# EAGLE design 5_TTY (EAGLE 7.6.0)
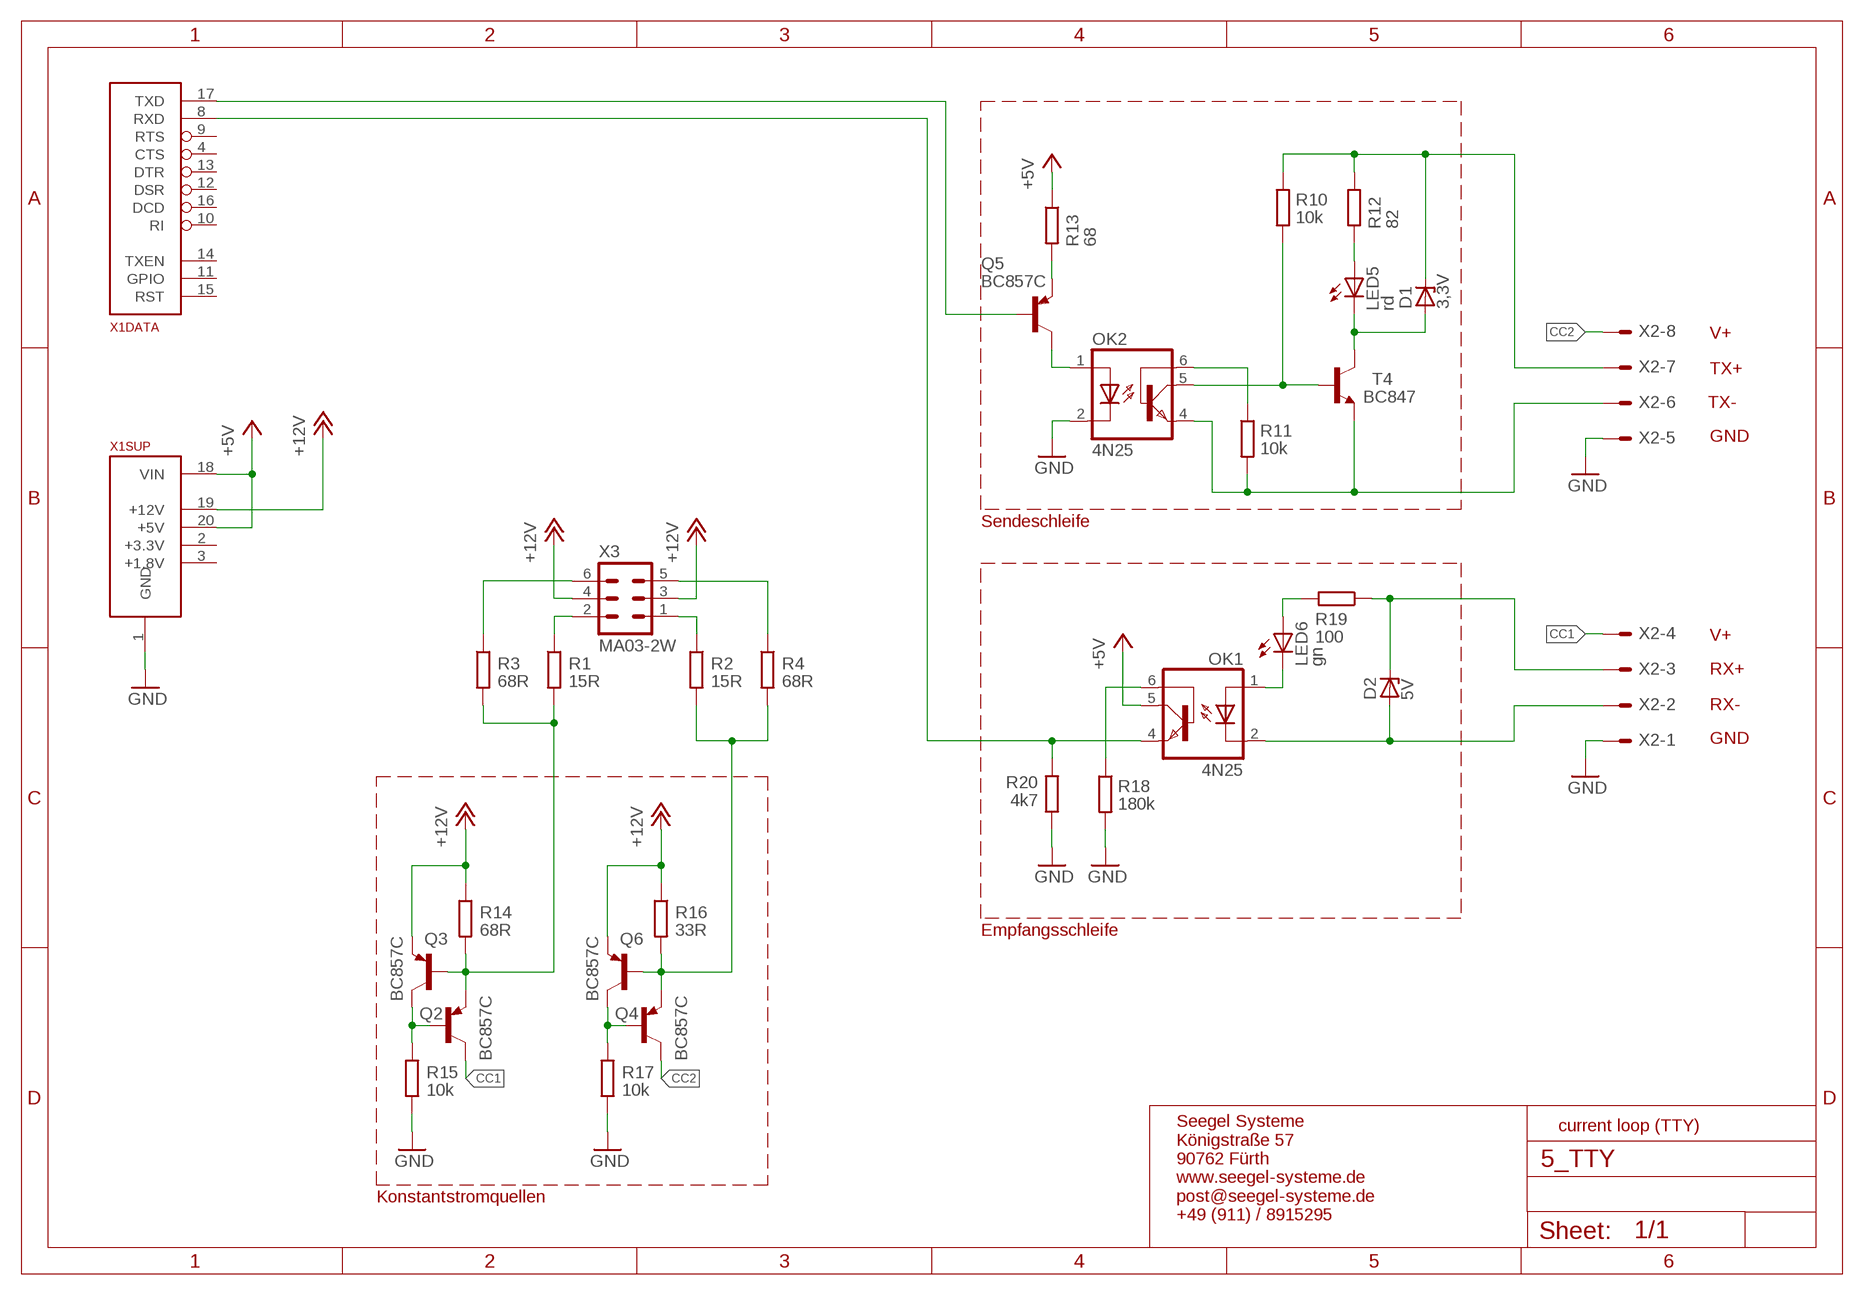
[diagram p0: schematic, sheet 1]

## Parts
D1  3,3V  ZENER-DIODESOT23  [SOT23]
D2  5V  ZENER-DIODESOT23  [SOT23]
LED5  rd  LEDCHIPLED_0603  [CHIPLED_0603]
LED6  gn  LEDCHIPLED_0603  [CHIPLED_0603]
OK1  4N25  4N35  [DIL06]
OK2  4N25  4N35  [DIL06]
Q2  BC857C  BC857CSMD  [SOT23-BEC]
Q3  BC857C  BC857CSMD  [SOT23-BEC]
Q4  BC857C  BC857CSMD  [SOT23-BEC]
Q5  BC857C  BC857CSMD  [SOT23-BEC]
Q6  BC857C  BC857CSMD  [SOT23-BEC]
R1  15R  R-EU_R0805  [R0805]
R2  15R  R-EU_R0805  [R0805]
R3  68R  R-EU_R0805  [R0805]
R4  68R  R-EU_R0805  [R0805]
R10  10k  R-EU_R0805  [R0805]
R11  10k  R-EU_R0805  [R0805]
R12  82  R-EU_R0805  [R0805]
R13  68  R-EU_R0805  [R0805]
R14  68R  R-EU_R0805  [R0805]
R15  10k  R-EU_R0805  [R0805]
R16  33R  R-EU_R0805  [R0805]
R17  10k  R-EU_R0805  [R0805]
R18  180k  R-EU_R0805  [R0805]
R19  100  R-EU_R0805  [R0805]
R20  4k7  R-EU_R0805  [R0805]
T4  BC847  [SOT23]
X1  ALLSERIALSLAVE  [DAUGHTER-THT]
X2  AKL18X-08W  [AKL182-08]
X3  MA03-2W  [MA03-2W]

## Nets
+5V: OK1.5(COL) R13.1 X1.18(SUP:VIN) X1.20(SUP:+5V)
+12V: Q3.E Q6.E R14.1 R16.1 X1.19(SUP:+12V) X3.3 X3.4
CC1: Q2.C X2.P$4
CC2: Q4.C X2.P$8
GND: OK2.2(C) R15.1 R17.1 R18.2 R20.1 X1.1(SUP:GND) X2.P$1 X2.P$5
N$1: OK1.6(BAS) R18.1
N$2: R1.1 X3.2
N$3: R2.1 X3.1
N$4: OK2.4(EMI) R11.2 T4.2(E) X2.P$6
N$5: R3.1 X3.6
N$6: R4.1 X3.5
N$7: D2.3(C) R19.1 X2.P$3
N$8: D2.1(A) OK1.2(C) X2.P$2
N$45: Q4.B Q6.C R17.2
N$46: OK1.4(EMI) R20.2 X1.8(DATA:RXD)
N$49: Q4.E Q6.B R2.2 R4.2 R16.2
N$54: OK2.6(BAS) R11.1
N$55: OK2.5(COL) R10.2 T4.1(B)
N$56: D1.1(A) LED5.C T4.3(C)
N$57: Q2.B Q3.C R15.2
N$58: LED5.A R12.2
N$59: Q2.E Q3.B R1.2 R3.2 R14.2
N$60: OK2.1(A) Q5.C
N$61: Q5.E R13.2
N$63: LED6.C OK1.1(A)
N$64: LED6.A R19.2
N$91: Q5.B X1.17(DATA:TXD)
TXP: D1.3(C) R10.1 R12.1 X2.P$7
Unconnected: X1.2(SUP:+3.3V) X1.3(SUP:+1.8V) X1.4(DATA:CTS) X1.5(USB:D-) X1.6(USB:D+) X1.7(USB:VUSB) X1.9(DATA:RTS) X1.10(DATA:RI) X1.11(DATA:GPIO) X1.12(DATA:DSR) X1.13(DATA:DTR) X1.14(DATA:TXEN) X1.15(DATA:RST) X1.16(DATA:DCD)

## Notes on the sheet
- V+
- TX+
- TX-
- GND
- Sendeschleife
- V+
- RX+
- RX-
- GND
- Empfangsschleife
- current loop (TTY)
- Konstantstromquellen
- Seegel Systeme
  Königstraße 57
  90762 Fürth
  www.seegel-systeme.de
  post@seegel-systeme.de
  +49 (911) / 8915295

## Library data of the parts
D1 D2 = diode:ZENER-DIODE: Z-Diode
LED5 LED6 = led:LED: LED OSRAM: - CHIPLED LG R971, LG N971, LY N971, LG Q971, LY Q971, LO R971, LY R971 LH N974, LH R974 LS Q976, LO Q976, LY Q976 LO Q996 - Hyper CHIPLED LW Q18S LB Q993, LB Q99A, LB R99A - SideLED LS A670, LO A670, LY A670, LG A670, LP A670 LB A673, LV A673, LT A673, LW A673 LH A674 LY A675 LS A676, LA A676, LO A676, LY A676, LW A676 LS A679, LY A679, LG A679 - Hyper Micro SIDELED® LS Y876, LA Y876, LO Y876, LY Y876 LT Y87S - SmartLED LW L88C, LW L88S LB L89C, LB L89S, LG L890 LS L89K, LO L89K, LY L89K LS L896, LA L896, LO L896, LY L896 - TOPLED LS T670, LO T670, LY T670, LG T670, LP T670 LSG T670, LSP T670, LSY T670, LOP T670, LYG T670 LG T671, LOG T671, LSG T671 LB T673, LV T673, LT T673, LW T673 LH T674 LS T676, LA T676, LO T676, LY T676, LB T676, LH T676, LSB T676, LW T676 LB T67C, LV T67C, LT T67C, LS T67K, LO T67K, LY T67K, LW E67C LS E67B, LA E67B, LO E67B, LY E67B, LB E67C, LV E67C, LT E67C LW T67C LS T679, LY T679, LG T679 LS T770, LO T770, LY T770, LG T770, LP T770 LB T773, LV T773, LT T773, LW T773 LH T774 LS E675, LA E675, LY E675, LS T675 LS T776, LA T776, LO T776, LY T776, LB T776 LHGB T686 LT T68C, LB T68C - Hyper Mini TOPLED® LB M676 - Mini TOPLED Santana® LG M470 LS M47K, LO M47K, LY M47K Source: http://www.osram.convergy.de LUXEON: - LUMILED® LXK2-PW12-R00, LXK2-PW12-S00, LXK2-PW14-U00, LXK2-PW14-V00 LXK2-PM12-R00, LXK2-PM12-S00, LXK2-PM14-U00 LXK2-PE12-Q00, LXK2-PE12-R00, LXK2-PE12-S00, LXK2-PE14-T00, LXK2-PE14-U00 LXK2-PB12-K00, LXK2-PB12-L00, LXK2-PB12-M00, LXK2-PB14-N00, LXK2-PB14-P00, LXK2-PB14-Q00 LXK2-PR12-L00, LXK2-PR12-M00, LXK2-PR14-Q00, LXK2-PR14-R00 LXK2-PD12-Q00, LXK2-PD12-R00, LXK2-PD12-S00 LXK2-PH12-R00, LXK2-PH12-S00 LXK2-PL12-P00, LXK2-PL12-Q00, LXK2-PL12-R00 Source: www.luxeon.com KINGBRIGHT: KA-3528ASYC Source: www.kingbright.com
OK1 OK2 = optocoupler:4N35: MOTOROLA OPTO COUPLER; FARNELL: 1612454; MF: FAIRCHILD SEMICONDUCTOR; MPN: 4N35; OC_FARNELL: 1328375; OC_NEWARK: 72K9946
Q2-Q6 = transistor-pnp:BC857*: PNP Transistror; FARNELL: 8734771
R1-R4 R14 R16 = resistor:R-EU_: RESISTOR, European symbol; FARNELL: 2498090
R10 R11 R18 = resistor:R-EU_: RESISTOR, European symbol; FARNELL: 2498051
R12 R13 R19 = resistor:R-EU_: RESISTOR, European symbol; FARNELL: 2498057
R15 R17 = resistor:R-EU_: RESISTOR, European symbol; FARNELL: 2502672
R20 = resistor:R-EU_: RESISTOR, European symbol; FARNELL: 2498050
T4 = transistor:BC847: NPN TRANSISTOR; FARNELL: 1081230
X1 = AllSerialv2:ALLSERIALSLAVE
X2 = con-riacon_akl:AKL18X-08: Riacon AKL18X Steckverbinder 8-Pol Grid = 3,5mm
X3 = con-lstb:MA03-2W

## Board
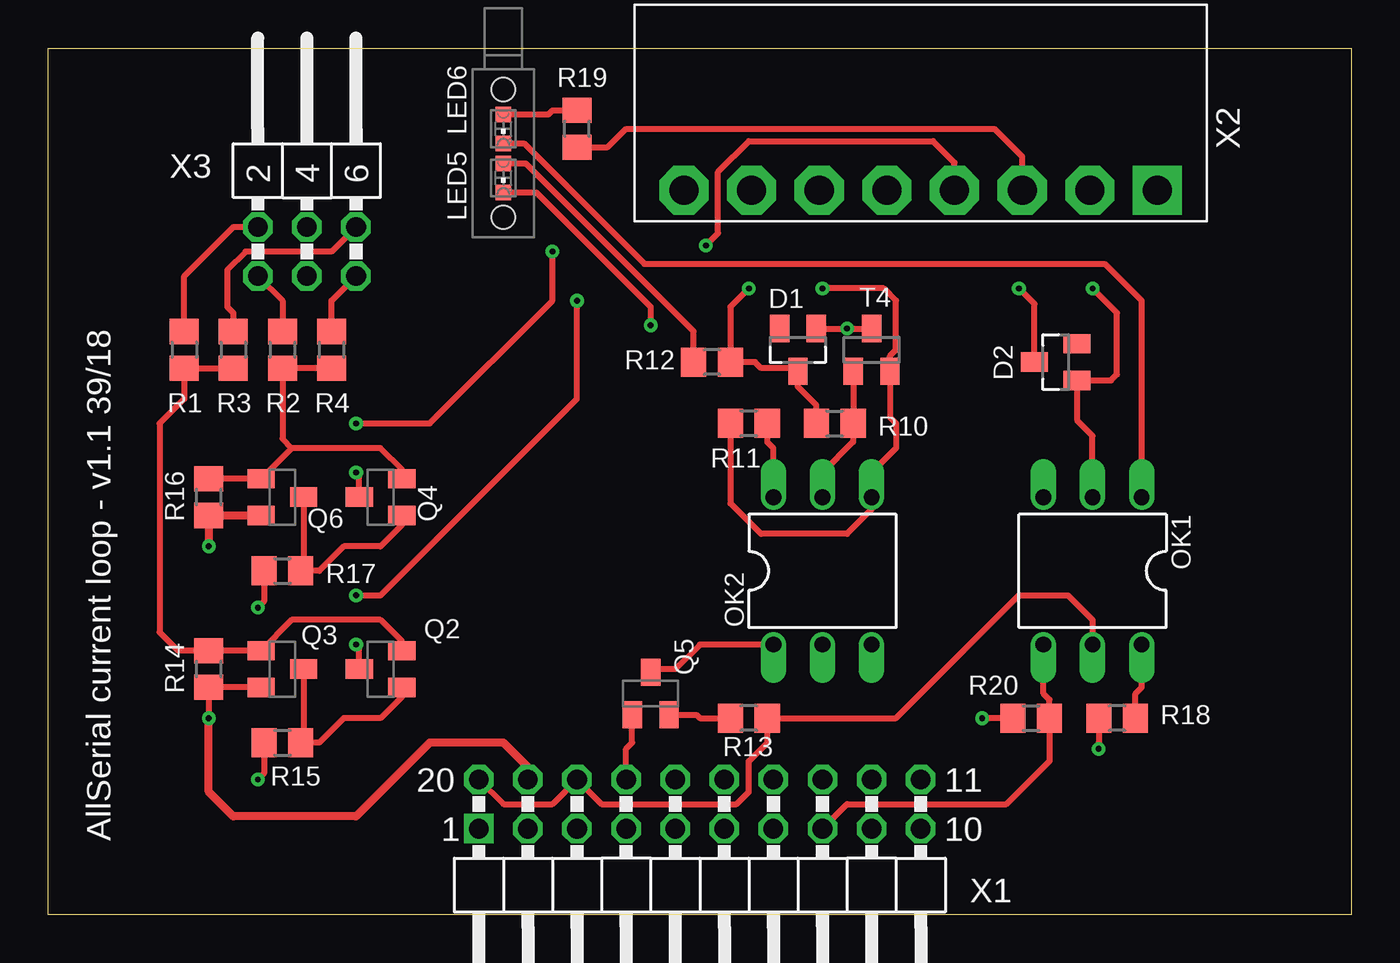
[diagram p1: board, top side]
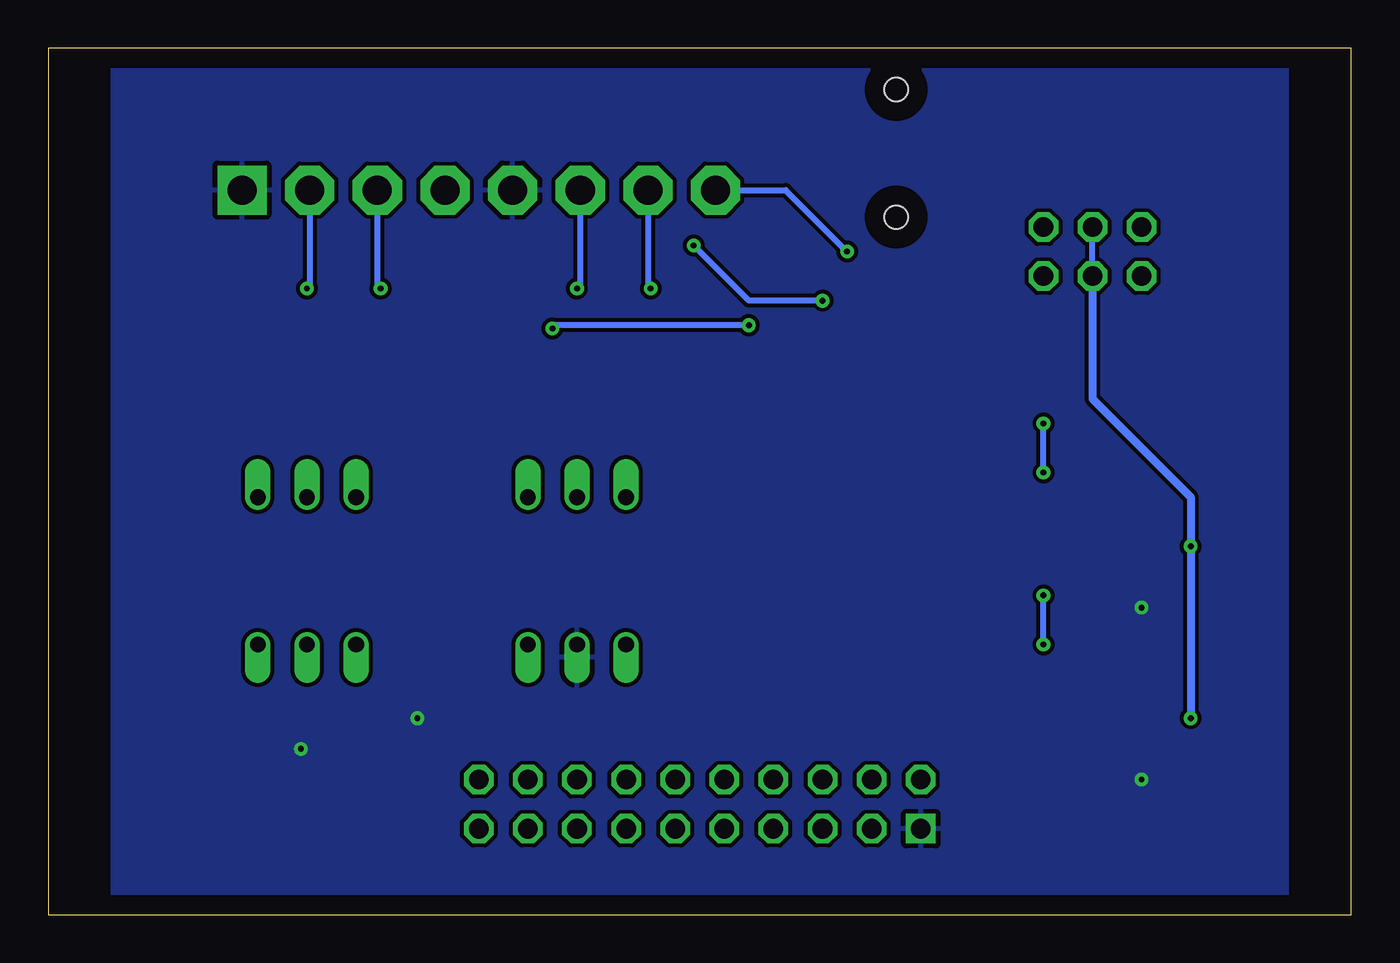
[diagram p2: board, bottom side, seen from below]

Size 67.4 x 44.8 mm. Coordinates in mm from the lower left corner, seen from the top.
Copper layers (1*16): Top 0.035mm / dielectric 1.5mm / Bottom 0.035mm
Design rules "default *": minimum track width 10mil, minimum drill 0.3mm, track to track 8mil, track to pad 8mil, pad to pad 8mil, via to via 8mil, smd to smd 8mil, copper to edge 40mil, drill to drill 8mil, minimum pad ring 10mil, minimum via ring 8mil, stop-mask expansion 4mil, vias tented up to drill 0.3mm, thermal gap 10mil

### Footprints (pad centres in the part's own frame; a part is rotated, then mirrored left to right if it is on the bottom)
SOT23 = smd 1 x 1.4: 1 -0.95,-1.1; 2 0.95,-1.1; 3 0,1.1
CHIPLED_0603 = smd 0.8 x 0.8: A 0,-0.75; C 0,0.75
DIL06 = drill 0.813 offset: 1 -2.54,-3.81; 2 0,-3.81; 3 2.54,-3.81; 4 2.54,3.81; 5 0,3.81; 6 -2.54,3.81
SOT23-BEC = smd 1 x 1.4: B -0.95,-1.1; C 0,1.1; E 0.95,-1.1
R0805 = smd 1.3 x 1.5: 1 -0.95,0; 2 0.95,0
1296.2012 = hole 1.2: 0,3.3; 0,-3.3
DAUGHTER-THT = drill 1.016 square: 1 -11.43,4.445 | drill 1.016 octagon: 2 -8.89,4.445; 3 -6.35,4.445; 4 -3.81,4.445; 5 -1.27,4.445; 6 1.27,4.445; 7 3.81,4.445; 8 6.35,4.445; 9 8.89,4.445; 10 11.43,4.445; 11 11.43,6.985; 12 8.89,6.985; 13 6.35,6.985; 14 3.81,6.985; 15 1.27,6.985; 16 -1.27,6.985; 17 -3.81,6.985; 18 -6.35,6.985; 19 -8.89,6.985; 20 -11.43,6.985
AKL182-08 = drill 1.5 pad 2.54 square: P$1 -12.25,0 | drill 1.5 pad 2.54 octagon: P$2 -8.75,0; P$3 -5.25,0; P$4 -1.75,0; P$5 1.75,0; P$6 5.25,0; P$7 8.75,0; P$8 12.25,0
MA03-2W = drill 1.016 octagon: 1 -2.54,-1.27; 2 -2.54,1.27; 3 0,-1.27; 4 0,1.27; 5 2.54,-1.27; 6 2.54,1.27

### Placement (x,y rotation side)
D1  38.78,29.21 180 top
D2  52.12,28.57 90 top
LED5  23.54,38.1 180 top
LED6  23.54,40.64 180 top
OK1  54.02,17.78 180 top
OK2  40.05,17.78 0 top
Q2  17.19,12.7 90 top
Q3  12.11,12.7 270 top
Q4  17.19,21.59 90 top
Q5  31.16,11.43 0 top
Q6  12.11,21.59 270 top
R1  7.03,29.21 270 top
R2  12.11,29.21 270 top
R3  9.57,29.21 270 top
R4  14.65,29.21 270 top
R10  40.69,25.4 0 top
R11  36.24,25.4 180 top
R12  34.34,28.57 180 top
R13  36.24,10.16 180 top
R14  8.3,12.7 90 top
R15  12.11,8.89 0 top
R16  8.3,21.59 90 top
R17  12.11,17.78 0 top
R18  55.29,10.16 180 top
R19  27.35,40.64 90 top
R20  50.85,10.16 0 top
T4  42.59,29.21 0 top
U$7  [1296.2012]  23.54,39.37 0 top
X1  33.7,0 0 top
X2  45.13,37.47 180 top
X3  13.38,34.29 0 top

### Tracks (layer width: path | path; a pad name or v marks a point on that pad's centre or on a via)
+5V
  Top 0.305: X1.20 23.54,5.71 26.08,5.71 X1.18 28.62,5.71 35.61,5.71 36.24,6.35 36.24,7.94 37.19,8.89 R13.1 43.86,10.16 50.21,16.51 52.75,16.51 54.02,15.24 OK1.5
+12V  (via drill 0.3)
  Top 0.305: Q3.E R14.1 v8.3,10.16
  Top 0.406: Q6.E R16.1 v8.3,19.05 | X1.19 24.81,7.62 23.54,8.89 19.73,8.89 15.92,5.08 9.57,5.08 8.3,6.35 v8.3,10.16
  Bottom 0.305: X3.3 X3.4
  Bottom 0.406: v8.3,10.16 v8.3,19.05 8.3,21.59 13.38,26.67 X3.3
CC1  (via drill 0.3)
  Top 0.305: Q2.C 16.09,13.8 v15.92,13.97 | v15.92,16.51 17.19,16.51 27.35,26.67 v27.35,31.75 | v34.02,34.61 34.65,35.24 34.65,38.42 36.24,40.01 45.77,40.01 46.88,38.89 X2.P$4
  Bottom 0.305: v15.92,13.97 v15.92,16.51 | v27.35,31.75 31.16,31.75 v34.02,34.61
CC2  (via drill 0.3)
  Top 0.305: Q4.C 16.09,22.69 v15.92,22.86 | v15.92,25.4 19.73,25.4 26.08,31.75 v26.08,34.29
  Bottom 0.305: X2.P$8 29.26,37.47 v26.08,34.29 | v15.92,22.86 v15.92,25.4
GND  (via drill 0.3)
  Top 0.305: R15.1 11.16,7.3 v10.84,6.99 | R17.1 11.16,16.2 v10.84,15.88 | R20.1 v48.31,10.16 | R18.2 54.34,8.89 v54.34,8.57
  pour Bottom: -0.59,0 67.99,0 67.99,45.72 -0.59,45.72
N$1
  Top 0.305: R18.1 56.24,11.43 56.56,11.75 OK1.6
N$2
  Top 0.305: X3.2 9.57,35.56 7.03,33.02 R1.1
N$3
  Top 0.305: X3.1 12.11,31.75 R2.1
N$4  (via drill 0.3)
  Top 0.305: R11.2 35.29,21.27 36.88,19.68 41.32,19.68 42.59,20.95 OK2.4 42.59,22.86 43.86,24.13 43.86,25.4 43.54,25.72 T4.2 | 43.71,27.94 T4.2 | T4.2 43.54,28.89 43.86,29.21 43.86,31.75 43.23,32.38 v40.05,32.38
  Bottom 0.305: X2.P$6 39.88,32.55 v40.05,32.38
N$5
  Top 0.305: X3.6 14.65,34.29 10.21,34.29 9.25,33.34 9.25,31.43 9.57,31.11 R3.1
N$6
  Top 0.305: R4.1 14.65,31.75 X3.5
N$7  (via drill 0.3)
  Top 0.305: R19.1 28.94,39.69 29.89,40.64 48.94,40.64 50.38,39.2 X2.P$3 | D2.3 51.02,31.58 v50.21,32.38
  Bottom 0.305: X2.P$3 50.38,32.55 v50.21,32.38
N$8  (via drill 0.3)
  Top 0.305: v54.02,32.38 55.29,31.11 55.29,27.94 54.98,27.62 D2.1 53.22,25.57 54.02,24.77 OK1.2
  Bottom 0.305: X2.P$2 53.88,32.52 v54.02,32.38
N$45
  Top 0.305: Q6.C 13.21,17.93 R17.2 14.02,17.78 15.29,19.05 17.19,19.05 18.29,20.15 Q4.B
N$46
  Top 0.305: OK1.4 51.48,11.43 51.8,11.12 R20.2 51.8,7.93 49.58,5.71 41.32,5.71 X1.8
N$49
  Top 0.305: Q4.E 18.29,23.03 17.19,24.13 12.6,24.13 | 12.6,24.13 Q6.B R16.2 | R4.2 R2.2 12.11,24.62 12.6,24.13
N$54
  Top 0.305: OK2.6 37.51,24.13 37.19,24.45 R11.1
N$55
  Top 0.305: OK2.5 40.05,22.86 41.64,24.45 R10.2 T4.1
N$56  (via drill 0.3)
  Top 0.305: D1.1 v41.32,30.31 T4.3 | LED5.C 25.24,37.35 31.16,31.43 v31.16,30.48
  Bottom 0.305: v31.16,30.48 41.15,30.48 v41.32,30.31
N$57
  Top 0.305: Q3.C 13.21,9.04 R15.2 14.02,8.89 15.29,10.16 17.19,10.16 18.29,11.26 Q2.B
N$58
  Top 0.305: LED5.A 24.7,38.85 33.39,30.16 R12.2
N$59
  Top 0.305: Q2.E 18.29,14.14 17.19,15.24 12.6,15.24 Q3.B R14.2 6.72,13.65 5.76,14.61 5.76,25.4 7.03,26.67 R1.2 R3.2
N$60
  Top 0.305: OK2.1 33.7,13.97 32.43,12.7 31.33,12.7 Q5.C
N$61
  Top 0.305: Q5.E 33.53,10.33 33.7,10.16 R13.2
N$63
  Top 0.305: OK1.1 56.56,31.75 54.66,33.66 30.84,33.66 24.61,39.89 LED6.C
N$64
  Top 0.305: LED6.A 25.88,41.39 26.08,41.59 R19.2
N$91
  Top 0.305: X1.17 29.89,8.57 30.21,8.89 Q5.B
TXP  (via drill 0.3)
  Top 0.305: R10.1 39.74,26.35 38.78,27.3 D1.3 38.63,28.26 36.87,28.26 36.56,28.57 R12.1 35.29,31.43 v36.24,32.38
  Bottom 0.305: X2.P$7 36.38,32.52 v36.24,32.38

### Text on the board
tPlace: AllSerial current loop - v1.1 39/18